# Altium schematic sheet auto switch electric bike charger_schematic.SchDoc
size Letter
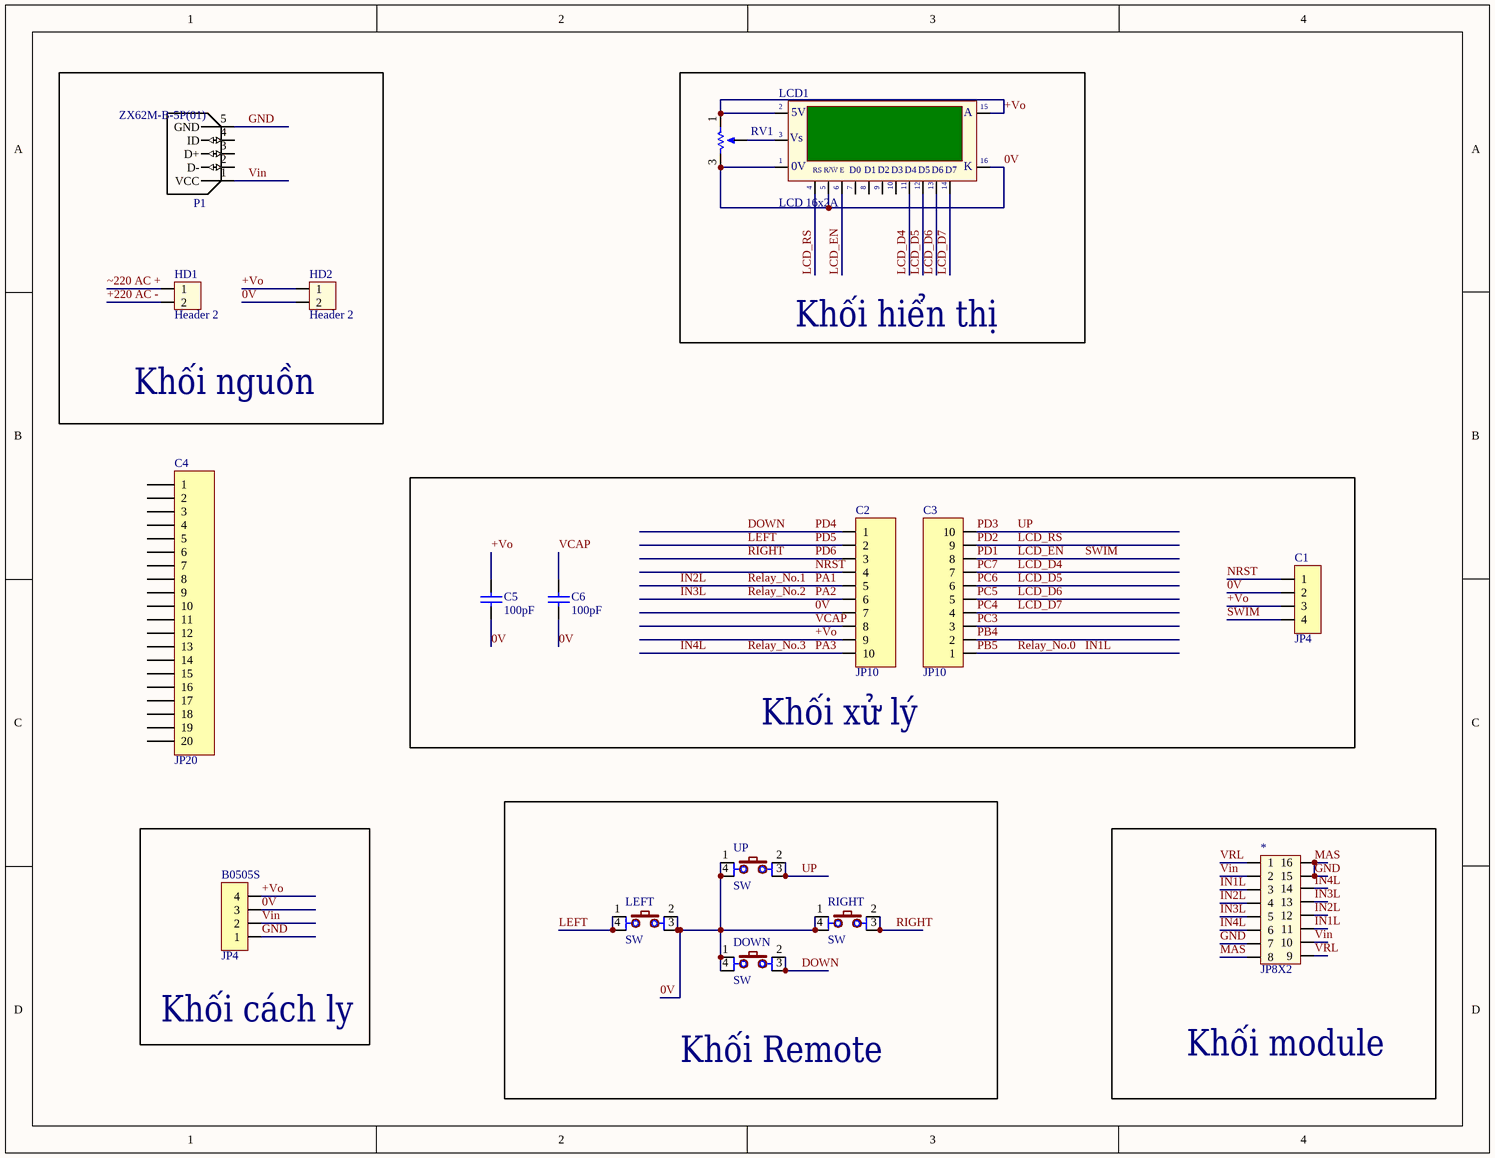
[diagram p0: auto switch electric bike charger_schematic.SchDoc]

## Parts
*  JP8X2  [JP8X2]
B0505S  JP4  [JP4-C1T]
C1  JP4  [JP4-C1T]
C2  JP10  [JP10-D1C]
C3  JP10  [JP10-D1C]
C4  JP20  [JP20-D1T]
C5  value 100pF  [CN1]  (hidden comment: Cap Non-Pol)
C6  value 100pF  [CN1]  (hidden comment: Cap Non-Pol)
DOWN  SW  [SW2-DIP]
HD1  Header 2  [HED2]
HD2  Header 2  [HED2]
LCD1  LCD 16x2A  [LCD16X2]
LEFT  SW  [SW2-DIP]
P1  ZX62M-B-5P(01)  [HRS_ZX62M-B-5P(01)]
RIGHT  SW  [SW2-DIP]
RV1  RV20K  [RVAR10K]  (value not drawn)
UP  SW  [SW2-DIP]

## Blocks framed on the sheet
Khối nguồn: HD1 HD2 P1
Khối hiển thị: LCD1 RV1
Khối xử lý: C1-C3 C5 C6
Khối cách ly: B0505S
Khối Remote: DOWN LEFT RIGHT UP
Khối module: *

## Nets
0V: B0505S.3 C1.2 C2.7 C5.2 C6.2 DOWN.1 DOWN.4 HD2.2 LCD1.1(GND) LCD1.5(R/~{W}) LCD1.16(K) LEFT.2 LEFT.3 RIGHT.1 RIGHT.4 RV1.3 UP.1 UP.4
+220 AC -: HD1.2
+Vo: B0505S.4 C1.3 C2.9 C5.1 HD2.1 LCD1.2(VDD) LCD1.15(A) RV1.1
DOWN: C2.1 DOWN.2 DOWN.3  [also labelled PD4]
GND: *.7 *.8 *.15 *.16 B0505S.1 P1.5(GND)  [also labelled MAS]
IN1L: *.3 *.11 C3.1  [also labelled PB5, Relay_No.0]
IN2L: *.4 *.12 C2.5  [also labelled PA1, Relay_No.1]
IN3L: *.5 *.13 C2.6  [also labelled PA2, Relay_No.2]
IN4L: *.6 *.14 C2.10  [also labelled PA3, Relay_No.3]
LCD_D4: C3.7 LCD1.11(D4)  [also labelled PC7]
LCD_D5: C3.6 LCD1.12(D5)  [also labelled PC6]
LCD_D6: C3.5 LCD1.13(D6)  [also labelled PC5]
LCD_D7: C3.4 LCD1.14(D7)  [also labelled PC4]
LCD_EN: C1.4 C3.8 LCD1.6(~{EN})  [also labelled PD1, SWIM]
LCD_RS: C3.9 LCD1.4(RS)  [also labelled PD2]
LEFT: C2.2 LEFT.1 LEFT.4  [also labelled PD5]
NRST: C1.1 C2.4
PB4: C3.2
PC3: C3.3
PD3: C3.10 UP.2 UP.3  [also labelled UP]
PD6: C2.3 RIGHT.2 RIGHT.3  [also labelled RIGHT]
VCAP: C2.8 C6.1
Vin: *.2 *.10 B0505S.2 P1.1(VCC)
VRL: *.1 *.9
~220 AC +: HD1.1
NetLCD1_3: LCD1.3(VEE) RV1.2

Not connected (* = marked no-connect by the designer): C4 1 2 3 4 5 6 7 8 9 10 11 12 13 14 15 16 17 18 19 20; LCD1 7(D0) 8(D1) 9(D2) 10(D3); P1 2(D-) 3(D+) 4(ID)

## Notes on the sheet
- (in symbol LCD16x2A) 5V; Vs; |; 0V; R/W; E

## Library data of the parts
B0505S C1 = JP4: WR-PHD 2.54 mm Angled Socket Header; Manufacturer: W¨¹rth Elektronik eiSos GmbH; partNo: 613004143121; ComponentLink1 Description: Manufacturer; ComponentLink2 Description: Datasheet; NoPins: 04; Created Date: 29 March 2013; ComponentLink1URL: http://www.we-online.com; ComponentLink2URL: http://katalog.we-online.de/em/datasheet/6130xx143121.pdf; Created by: Karrer Zheng
C2 C3 = JP10: WR-PHD 2.54 mm Angled Socket Header; Manufacturer: W¨¹rth Elektronik eiSos GmbH; partNo: 613010143121; ComponentLink1 Description: Manufacturer; ComponentLink2 Description: Datasheet; NoPins: 10; Created Date: 29 March 2013; ComponentLink1URL: http://www.we-online.com; ComponentLink2URL: http://katalog.we-online.de/em/datasheet/6130xx143121.pdf; Created by: Karrer Zheng
C4 = JP20: WR-PHD 2.54 mm Angled Socket Header; Manufacturer: W¨¹rth Elektronik eiSos GmbH; partNo: 613020143121; ComponentLink1 Description: Manufacturer; ComponentLink2 Description: Datasheet; NoPins: 20; Created Date: 29 March 2013; ComponentLink1URL: http://www.we-online.com; ComponentLink2URL: http://katalog.we-online.de/em/datasheet/6130xx143121.pdf; Created by: Karrer Zheng
C5 C6 = Cap Non-Pol: Capacitor
DOWN LEFT RIGHT UP = SW4: Switch button 4 pin; Value: Button chip 4 pin
HD1 HD2 = Hed2: Header 2 (Green); Value: Header 2
LCD1 = LCD16x2A: LCD dipslay 16 char, 2 line; Value: LCD16x2A
P1 = ZX62M-B-5P(01): Conn Rcpt Micro Usb b Mid Mnt; MF: Hirose; Availability: Unavailable; Price: None; SnapEDA_Link: https://www.snapeda.com/parts/ZX62M-B-5P/Hirose%20Electric%20Co%20Ltd/view-part/?ref=snap; MP: ZX62M-B-5P; Package: None; Value: *
RV1 = Variable Resistor: Sim Note: Enter the Resistance value and the set point into parameter fields.; Set Position: 0.5; Published: 8-Jun-2000; LatestRevisionDate: 17-Jul-2002; LatestRevisionNote: Re-released for DXP Platform.; PackageReference: VR5; Publisher: Altium Limited